# EAGLE design xvim-001 (EAGLE 9.6.2)
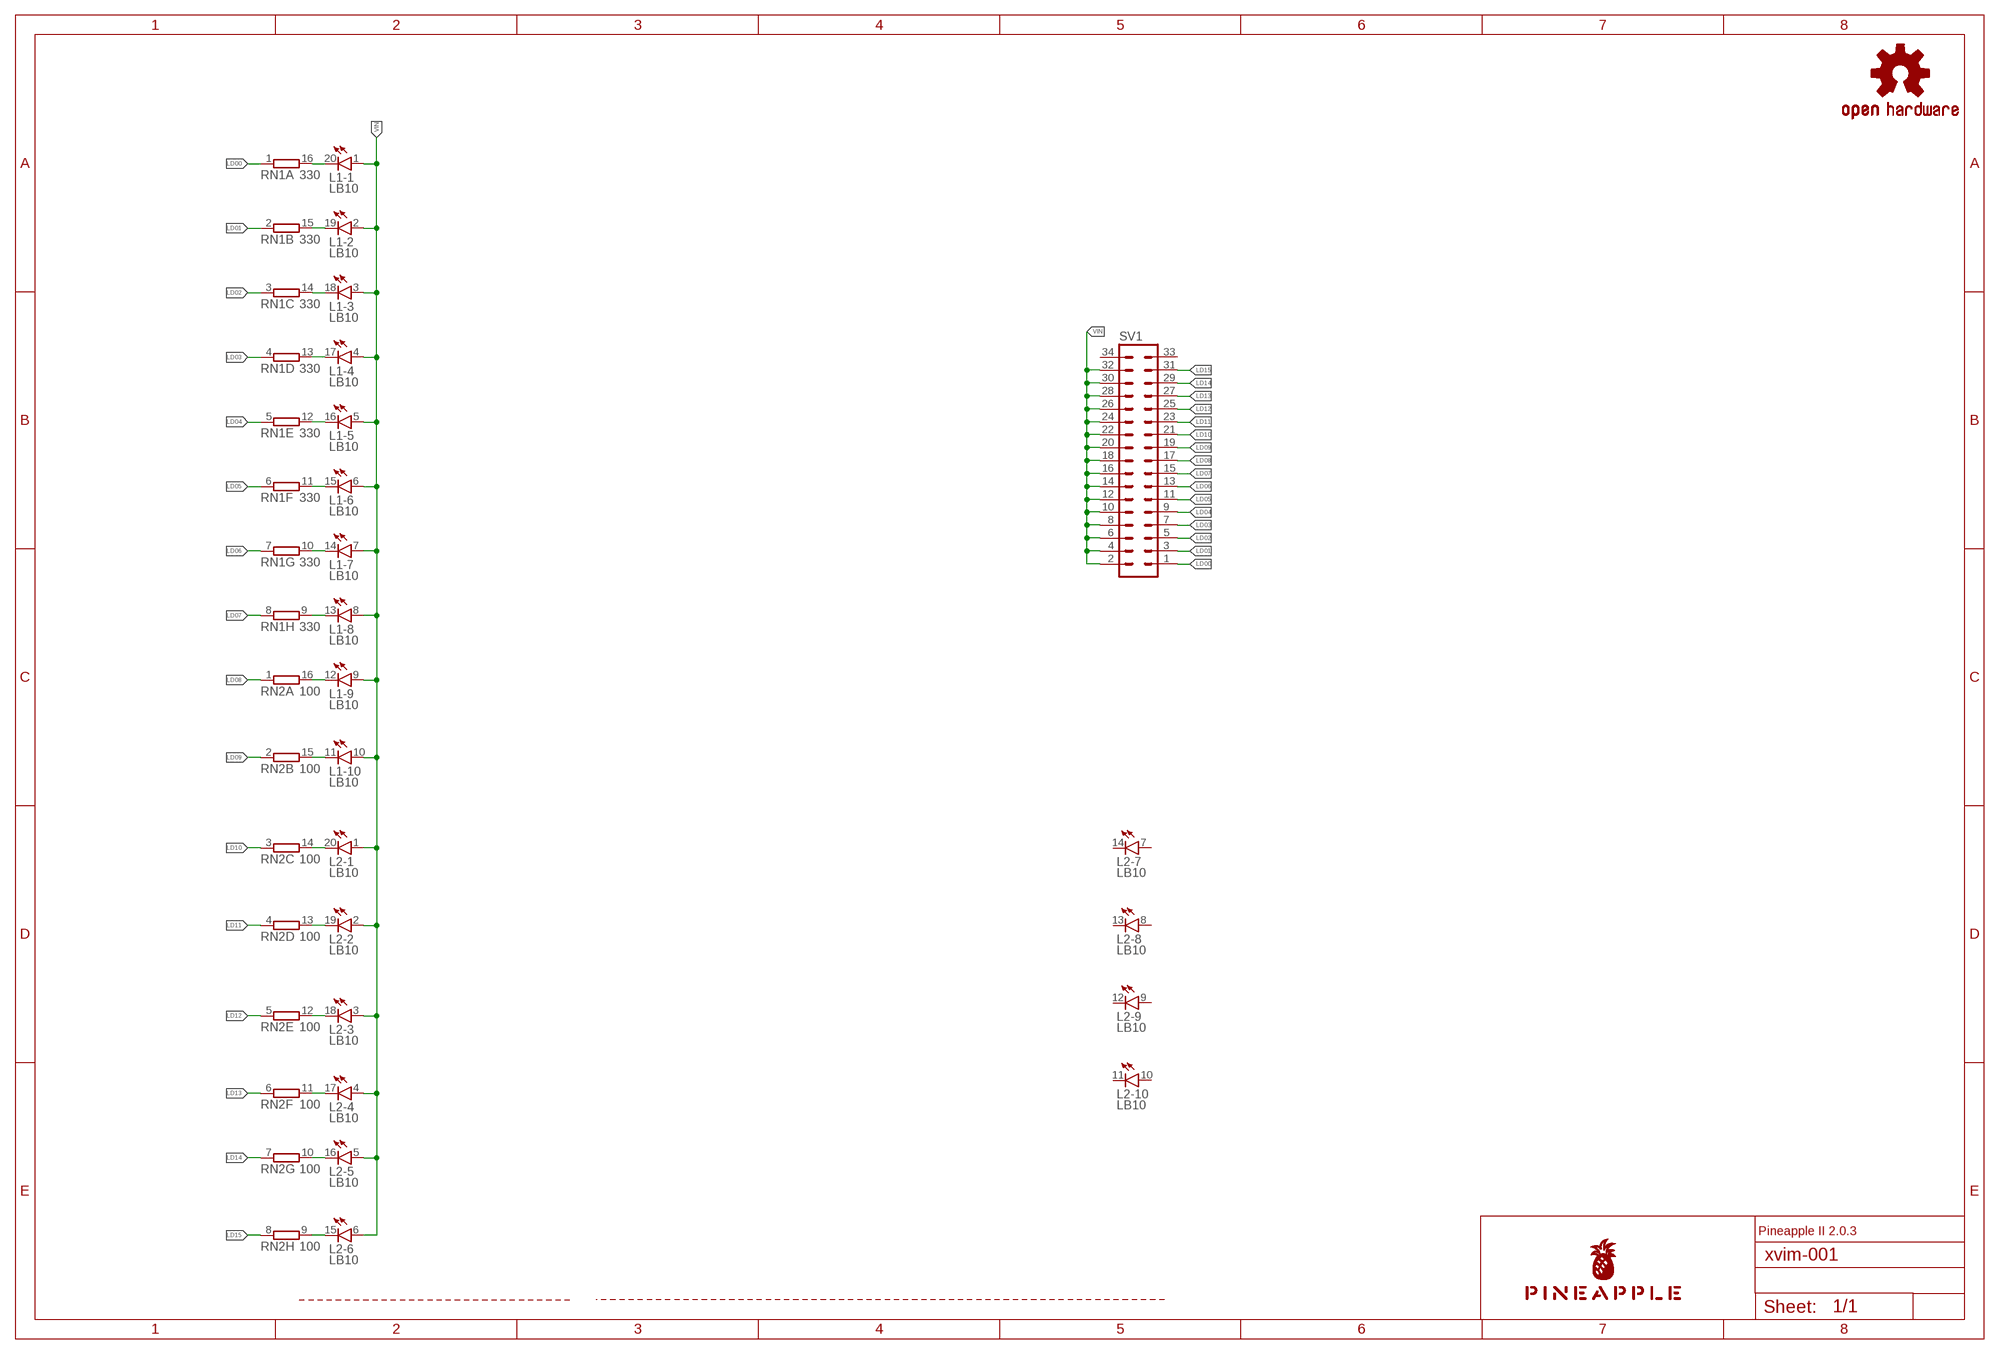
[diagram p0: schematic, sheet 1]

## Parts
L1  LB10  [LB10]
L2  LB10  [LB10]
LOGO1  OSHW-LOGOS-COPPER  [OSHW-LOGO-S_COPPER]
RN1  330  8R-N  [DIL16]
RN2  100  8R-N  [DIL16]
SV1  ML34L  [ML34L]
U$1  PINEAPPLE450_SILK  [PINEAPPLE450_SILK]

## Nets
LD00: RN1.1 SV1.1
LD01: RN1.2 SV1.3
LD02: RN1.3 SV1.5
LD03: RN1.4 SV1.7
LD04: RN1.5 SV1.9
LD05: RN1.6 SV1.11
LD06: RN1.7 SV1.13
LD07: RN1.8 SV1.15
LD08: RN2.1 SV1.17
LD09: RN2.2 SV1.19
LD10: RN2.3 SV1.21
LD11: RN2.4 SV1.23
LD12: RN2.5 SV1.25
LD13: RN2.6 SV1.27
LD14: RN2.7 SV1.29
LD15: RN2.8 SV1.31
LED1K: L1.20(-1:C) RN1.16
LED2K: L1.19(-2:C) RN1.15
LED3K: L1.18(-3:C) RN1.14
LED4K: L1.17(-4:C) RN1.13
LED5K: L1.16(-5:C) RN1.12
LED6K: L1.15(-6:C) RN1.11
N$1: L1.14(-7:C) RN1.10
N$2: L1.13(-8:C) RN1.9
N$3: L1.12(-9:C) RN2.16
N$4: L1.11(-10:C) RN2.15
N$5: L2.20(-1:C) RN2.14
N$6: L2.19(-2:C) RN2.13
N$7: L2.18(-3:C) RN2.12
N$8: L2.17(-4:C) RN2.11
N$9: L2.16(-5:C) RN2.10
N$10: L2.15(-6:C) RN2.9
VIN: L1.1(-1:A) L1.2(-2:A) L1.3(-3:A) L1.4(-4:A) L1.5(-5:A) L1.6(-6:A) L1.7(-7:A) L1.8(-8:A) L1.9(-9:A) L1.10(-10:A) L2.1(-1:A) L2.2(-2:A) L2.3(-3:A) L2.4(-4:A) L2.5(-5:A) L2.6(-6:A) SV1.2 SV1.4 SV1.6 SV1.8 SV1.10 SV1.12 SV1.14 SV1.16 SV1.18 SV1.20 SV1.22 SV1.24 SV1.26 SV1.28 SV1.30 SV1.32
Unconnected: L2.7(-7:A) L2.8(-8:A) L2.9(-9:A) L2.10(-10:A) L2.11(-10:C) L2.12(-9:C) L2.13(-8:C) L2.14(-7:C) SV1.33 SV1.34

## Notes on the sheet
- Pineapple II 2.0.3

## Library data of the parts
L1 L2 = led:LB10: LED BLOCK 10-LED bar graph, DIL, Siemens
LOGO1 = SparkFun-Aesthetics:OSHW-LOGO: Open-Source Hardware (OSHW) Logo This logo indicates the piece of hardware it is found on incorporates a OSHW license and/or adheres to the definition of open source hardware found here: http://freedomdefined.org/OSHW
RN1 RN2 = resistor-dil:8R-N: DIL RESISTOR; OC_FARNELL: unknown; OC_NEWARK: unknown
SV1 = con-ml:ML34L: HARTING; OC_FARNELL: unknown; OC_NEWARK: unknown
U$1 = pineapple:PINEAPPLE450_SILK

## Net classes
0 default: width 0.152 mm, drill 0.152 mm, clearance 0.152 mm
1 gnd: width 1.016 mm, drill 0.152 mm, clearance 0.152 mm
2 power: width 0.61 mm, drill 0.152 mm, clearance 0.152 mm
3 analog: width 0.305 mm, drill 0.152 mm, clearance 0.152 mm
4 superpower: width 1.016 mm, drill 0.152 mm, clearance 0.152 mm

## Board
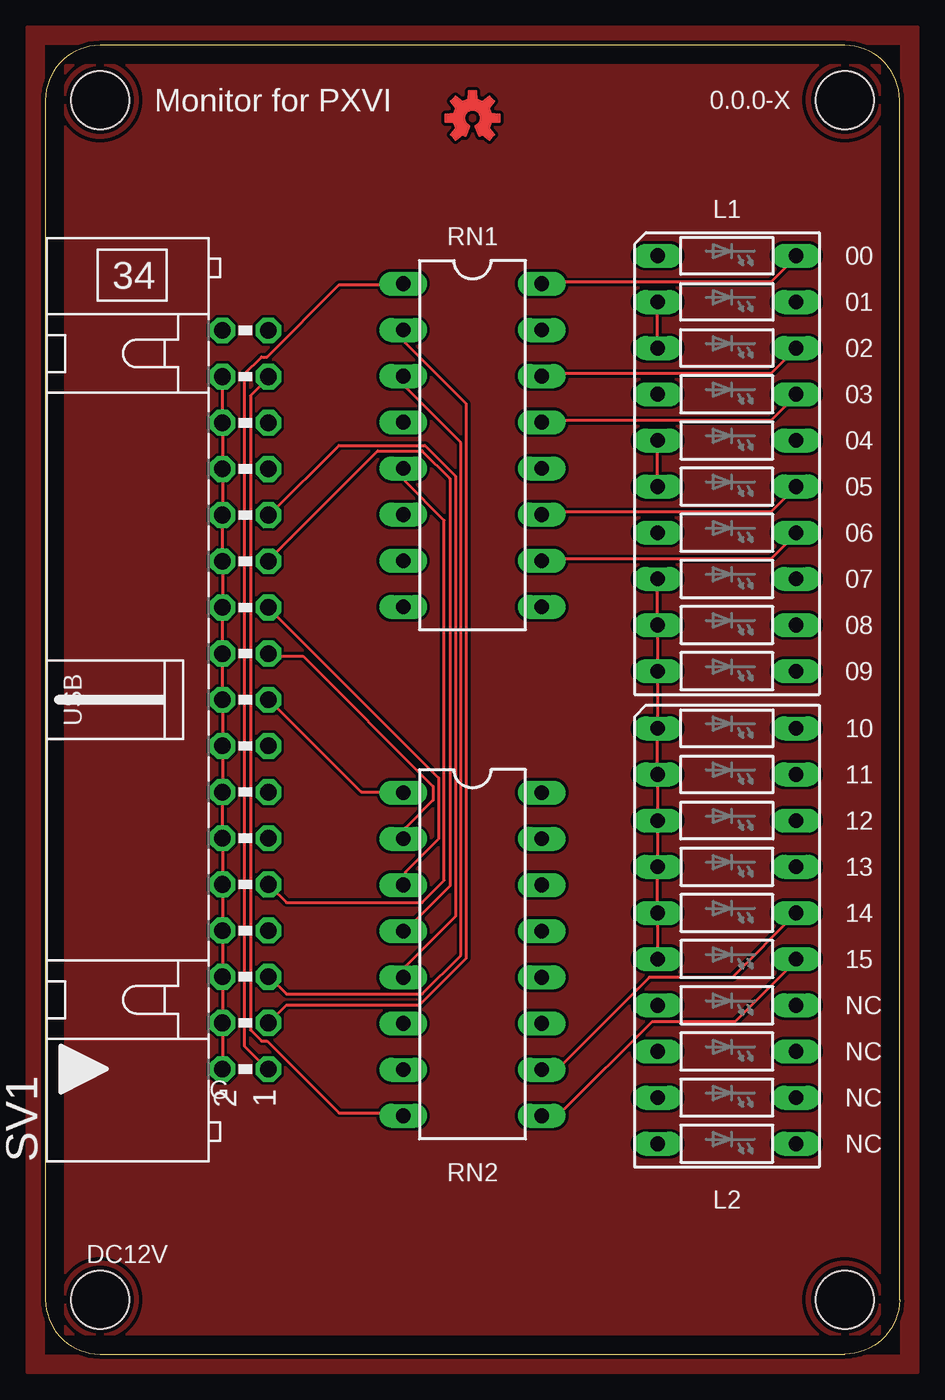
[diagram p1: board, top side]
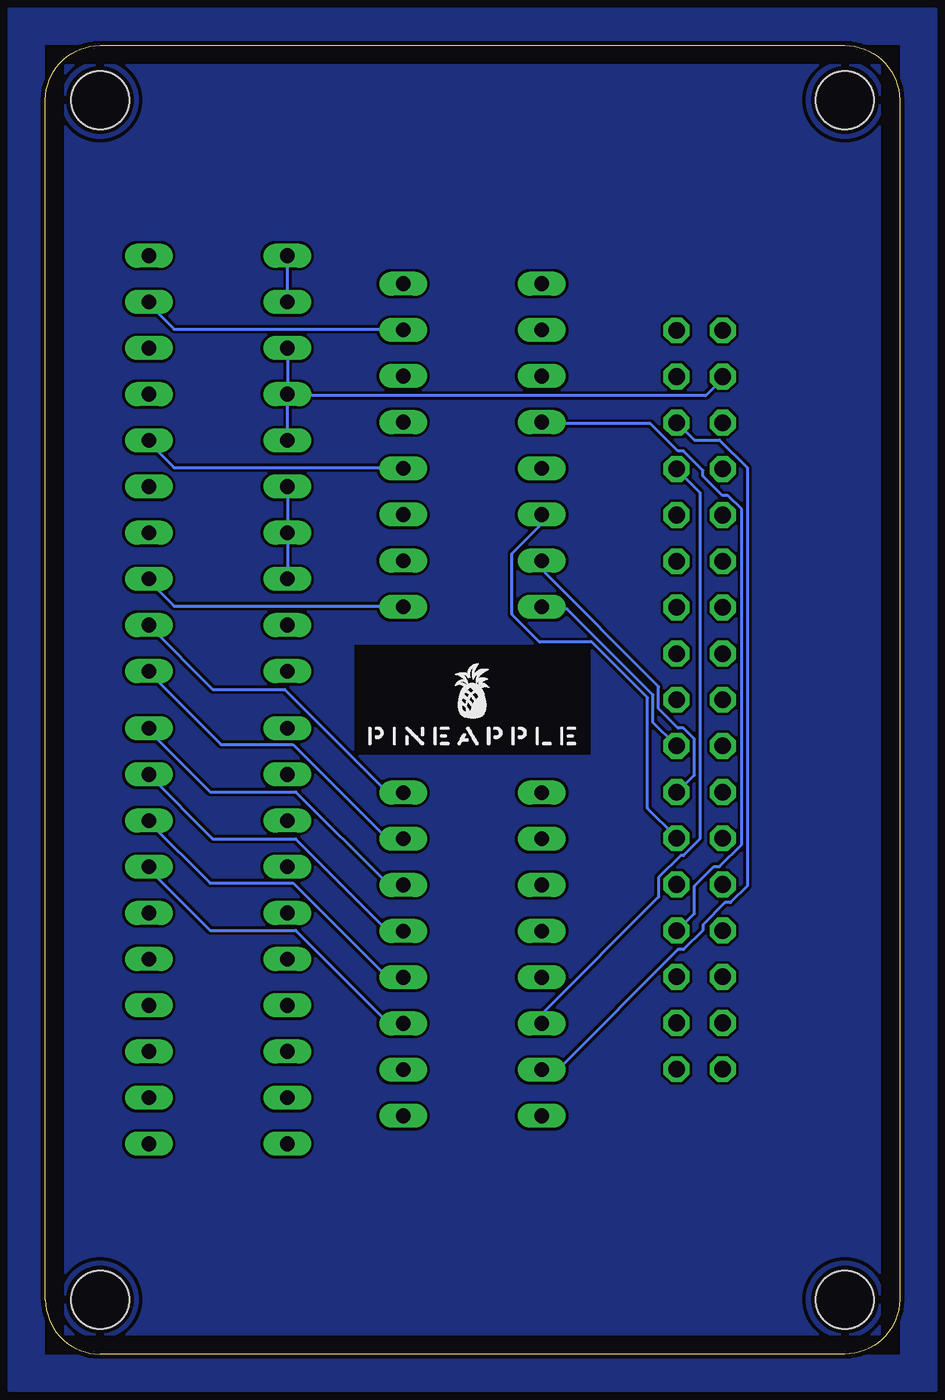
[diagram p2: board, bottom side, seen from below]

Size 47 x 72 mm. Coordinates in mm from the lower left corner, seen from the top.
Outline: 3,0 44,0 arc90 47,3 47,69 arc90 44,72 3,72 arc90 0,69 0,3 arc90 3,0
Copper layers (1*16): Top 0.035mm / dielectric 1.5mm / Bottom 0.035mm
Design rules "SeeedStudio_2layer_DRU_no_angle_20140221": minimum track width 6mil, minimum drill 12mil, track to track 6mil, track to pad 6mil, pad to pad 6mil, via to via 6mil, smd to smd 0mil, copper to edge 10mil, drill to drill 10mil, minimum pad ring 10mil, minimum via ring 6mil, stop-mask expansion 2mil, vias tented up to drill 100mil, thermal gap 10mil
Holes 3.2 mm at 3,3 3,69 44,69 44,3
tRestrict: area 0.8,66.8 to 5.2,71.2; area 0.8,0.8 to 5.2,5.2; area 41.8,66.8 to 46.2,71.2; area 41.8,0.8 to 46.2,5.2; area 0,71 to 47,72; area 0,0 to 47,1; area 0,0 to 1,72; area 46,0 to 47,72
bRestrict: area 0.8,0.8 to 5.2,5.2; area 0.8,66.8 to 5.2,71.2; area 41.8,66.8 to 46.2,71.2; area 41.8,0.8 to 46.2,5.2; area 0,71 to 47,72; area 0,0 to 47,1; area 0,0 to 1,72; area 46,0 to 47,72; area 17,33 to 30,39

### Footprints (pad centres in the part's own frame; a part is rotated, then mirrored left to right if it is on the bottom)
LB10 = drill 0.813 long: 1 -11.43,-3.81; 2 -8.89,-3.81; 3 -6.35,-3.81; 4 -3.81,-3.81; 5 -1.27,-3.81; 6 1.27,-3.81; 7 3.81,-3.81; 8 6.35,-3.81; 9 8.89,-3.81; 10 11.43,-3.81; 11 11.43,3.81; 12 8.89,3.81; 13 6.35,3.81; 14 3.81,3.81; 15 1.27,3.81; 16 -1.27,3.81; 17 -3.81,3.81; 18 -6.35,3.81; 19 -8.89,3.81; 20 -11.43,3.81
DIL16 = drill 0.813 long: 1 -8.89,-3.81; 2 -6.35,-3.81; 3 -3.81,-3.81; 4 -1.27,-3.81; 5 1.27,-3.81; 6 3.81,-3.81; 7 6.35,-3.81; 8 8.89,-3.81; 9 8.89,3.81; 10 6.35,3.81; 11 3.81,3.81; 12 1.27,3.81; 13 -1.27,3.81; 14 -3.81,3.81; 15 -6.35,3.81; 16 -8.89,3.81
ML34L = drill 0.914 octagon: 1 -20.32,-1.27; 2 -20.32,1.27; 3 -17.78,-1.27; 4 -17.78,1.27; 5 -15.24,-1.27; 6 -15.24,1.27; 7 -12.7,-1.27; 8 -12.7,1.27; 9 -10.16,-1.27; 10 -10.16,1.27; 11 -7.62,-1.27; 12 -7.62,1.27; 13 -5.08,-1.27; 14 -5.08,1.27; 15 -2.54,-1.27; 16 -2.54,1.27; 17 0,-1.27; 18 0,1.27; 19 2.54,-1.27; 20 2.54,1.27; 21 5.08,-1.27; 22 5.08,1.27; 23 7.62,-1.27; 24 7.62,1.27; 25 10.16,-1.27; 26 10.16,1.27; 27 12.7,-1.27; 28 12.7,1.27; 29 15.24,-1.27; 30 15.24,1.27; 31 17.78,-1.27; 32 17.78,1.27; 33 20.32,-1.27; 34 20.32,1.27

### Placement (x,y rotation side)
L1  37.5,49 270 top
L2  37.5,23 270 top
LOGO1  23.5,68 0 top
RN1  23.5,50 270 top
RN2  23.5,22 270 top
SV1  11,36 90 top
U$1  23.5,33.5 0 bottom

### Tracks (layer width: path | path; a pad name or v marks a point on that pad's centre or on a via)
GND
  pour Top: -1,-1 48,-1 48,73 -1,73
  pour Bottom: -2,-2 49,-2 49,74 -2,74
LD00
  Top 0.152: RN1.1 19.66,58.83 16.15,58.83 12.19,54.86 11.89,54.86 10.97,53.95 10.97,16.92 12.19,15.7 SV1.1
LD01
  Top 0.152: RN1.2 19.81,56.24 19.81,55.63 23.16,52.27 23.16,21.79 20.57,19.2 13.26,19.2 12.34,18.29 SV1.3
LD02
  Top 0.152: RN1.3 19.81,53.8 19.81,53.19 22.86,50.14 22.86,21.95 20.73,19.81 13.26,19.81 12.34,20.73 SV1.5
LD03
  Bottom 0.152: RN1.4 19.66,51.21 13.72,51.21 12.19,49.68 11.89,49.68 10.82,48.62 10.82,48.31 9.75,47.24 9.45,47.24 8.69,46.48 8.69,28.04 9.91,26.82 10.21,26.82 11.28,25.76 11.28,24.23 12.19,23.32 SV1.7
LD04
  Top 0.152: RN1.5 19.81,48.62 19.81,48.01 21.95,45.87 21.95,26.06 20.73,24.84 13.26,24.84 12.34,25.76 SV1.9
LD05
  Bottom 0.152: RN1.6 19.81,46.18 19.81,45.57 21.34,44.04 21.34,40.69 19.81,39.17 16.92,39.17 13.87,36.12 13.87,30.02 12.34,28.5 SV1.11
LD06
  Bottom 0.152: RN1.7 19.66,43.59 19.66,43.13 13.26,36.73 13.26,35.51 12.19,34.44 11.89,34.44 11.28,33.83 11.28,31.85 12.19,30.94 SV1.13
LD07
  Bottom 0.152: RN1.8 19.66,41 18.29,41 13.56,36.27 13.56,34.75 12.34,33.53 SV1.15
LD08
  Top 0.152: RN2.1 19.66,30.94 17.37,30.94 12.34,35.97 SV1.17
LD09
  Top 0.152: RN2.2 19.81,28.5 19.81,28.96 21.34,30.48 21.34,31.24 14.17,38.41 12.34,38.41 SV1.19
LD10
  Top 0.152: RN2.3 19.81,25.91 19.81,26.52 21.64,28.35 21.64,31.7 12.34,41 SV1.21
LD11
  Top 0.152: RN2.4 19.81,23.32 22.25,25.76 22.25,48.16 20.73,49.68 18.29,49.68 12.34,43.74 SV1.23
LD12
  Top 0.152: RN2.5 19.81,20.88 19.81,21.34 22.55,24.08 22.55,48.31 20.88,49.99 16.15,49.99 12.34,46.18 SV1.25
LD13
  Bottom 0.152: RN2.6 19.66,18.29 19.66,18.75 13.26,25.15 13.26,26.21 12.04,27.43 11.89,27.43 10.97,28.35 10.97,47.4 12.19,48.62 SV1.27
LD14
  Bottom 0.152: RN2.7 19.66,15.7 18.75,15.7 12.19,22.25 11.89,22.25 10.82,23.32 10.82,23.62 9.6,24.84 9.3,24.84 8.38,25.76 8.38,48.77 9.91,50.29 11.28,50.29 12.19,51.21 SV1.29
LD15
  Top 0.152: RN2.8 19.66,13.26 16.15,13.26 12.19,17.22 11.89,17.22 11.28,17.83 11.28,52.73 12.19,53.65 SV1.31
LED1K
  Top 0.152: RN1.16 27.43,58.98 39.93,58.98 41.3,60.35 L1.20
LED2K
  Bottom 0.152: RN1.15 27.43,56.39 39.93,56.39 41.3,57.76 L1.19
LED3K
  Top 0.152: RN1.14 27.43,53.95 39.93,53.95 41.3,55.32 L1.18
LED4K
  Top 0.152: RN1.13 27.43,51.36 39.93,51.36 41.3,52.73 L1.17
LED5K
  Bottom 0.152: RN1.12 27.43,48.77 39.93,48.77 41.3,50.14 L1.16
LED6K
  Top 0.152: RN1.11 27.43,46.33 39.93,46.33 41.3,47.7 L1.15
N$1
  Top 0.152: RN1.10 27.43,43.74 39.93,43.74 41.3,45.11 L1.14
N$2
  Bottom 0.152: RN1.9 27.43,41.15 39.93,41.15 41.3,42.52 L1.13
N$3
  Bottom 0.152: RN2.16 27.43,30.94 28.19,30.94 33.83,36.58 37.8,36.58 41.3,40.08 L1.12
N$4
  Bottom 0.152: RN2.15 27.43,28.5 28.35,28.5 33.38,33.53 37.34,33.53 41.3,37.49 L1.11
N$5
  Bottom 0.152: RN2.14 27.43,25.91 28.19,25.91 33.22,30.94 37.95,30.94 41.3,34.29 L2.20
N$6
  Bottom 0.152: RN2.13 27.43,23.32 28.19,23.32 33.22,28.35 37.8,28.35 41.3,31.85 L2.19
N$7
  Bottom 0.152: RN2.12 27.43,20.88 28.35,20.88 33.38,25.91 37.95,25.91 41.3,29.26 L2.18
N$8
  Bottom 0.152: RN2.11 27.43,18.29 28.19,18.29 33.22,23.32 37.95,23.32 41.3,26.67 L2.17
N$9
  Top 0.152: RN2.10 27.43,15.7 28.19,15.7 33.22,20.73 37.8,20.73 41.3,24.23 L2.16
N$10
  Top 0.152: RN2.9 27.43,13.26 28.35,13.26 33.38,18.29 37.95,18.29 41.3,21.64 L2.15
VIN
  Top 0.152: L2.6 33.68,21.79 33.68,24.23 L2.5 33.68,24.38 33.68,26.67 L2.4 33.68,26.82 33.68,29.26 L2.3 33.68,29.41 33.68,31.85 L2.2 33.68,32 33.68,34.29 L2.1 33.68,34.44 33.68,37.49 L1.10 33.68,37.64 33.68,40.08 L1.9 33.68,40.23 33.68,42.52 L1.8 | L1.2 33.68,57.76 33.68,55.47 L1.3 | L1.5 33.68,50.14 33.68,47.85 L1.6 | SV1.32 9.75,53.65 9.75,51.36 SV1.30 9.75,51.21 9.75,48.77 SV1.28 9.75,48.62 9.75,46.18 SV1.26 9.75,46.02 9.75,43.74 SV1.24 9.75,43.59 9.75,41.15 SV1.22 9.75,41 9.75,38.56 SV1.20 9.75,38.41 9.75,36.12 SV1.18 9.75,35.97 9.75,33.53 SV1.16 9.75,33.38 9.75,30.94 SV1.14 9.75,30.79 9.75,28.5 SV1.12 9.75,28.35 9.75,25.91 SV1.10 9.75,25.76 9.75,23.32 SV1.8 9.75,23.16 9.75,20.88 SV1.6 9.75,20.73 9.75,18.29 SV1.4 9.75,18.14 9.75,15.7 SV1.2
  Bottom 0.152: L1.3 33.68,55.32 33.68,52.88 L1.4 33.68,52.73 | L1.1 33.68,60.35 33.68,57.91 L1.2 | L1.6 33.68,47.7 33.68,45.26 L1.7 33.68,45.11 33.68,42.67 L1.8 | 33.68,52.73 33.68,50.29 L1.5 | 33.68,52.73 10.67,52.73 9.75,53.65 SV1.32

### Text on the board
tNames: Monitor for PXVI | 0.0.0-X | 00 | 01 | 02 | 03 | 04 | 05 | 06 | 07 | 08 | 09 | USB | 10 | 11 | 12 | 13 | 14 | 15 | NC | NC | G | NC | NC | DC12V